# EAGLE schematic xmosio1 (EAGLE 7.6.0)
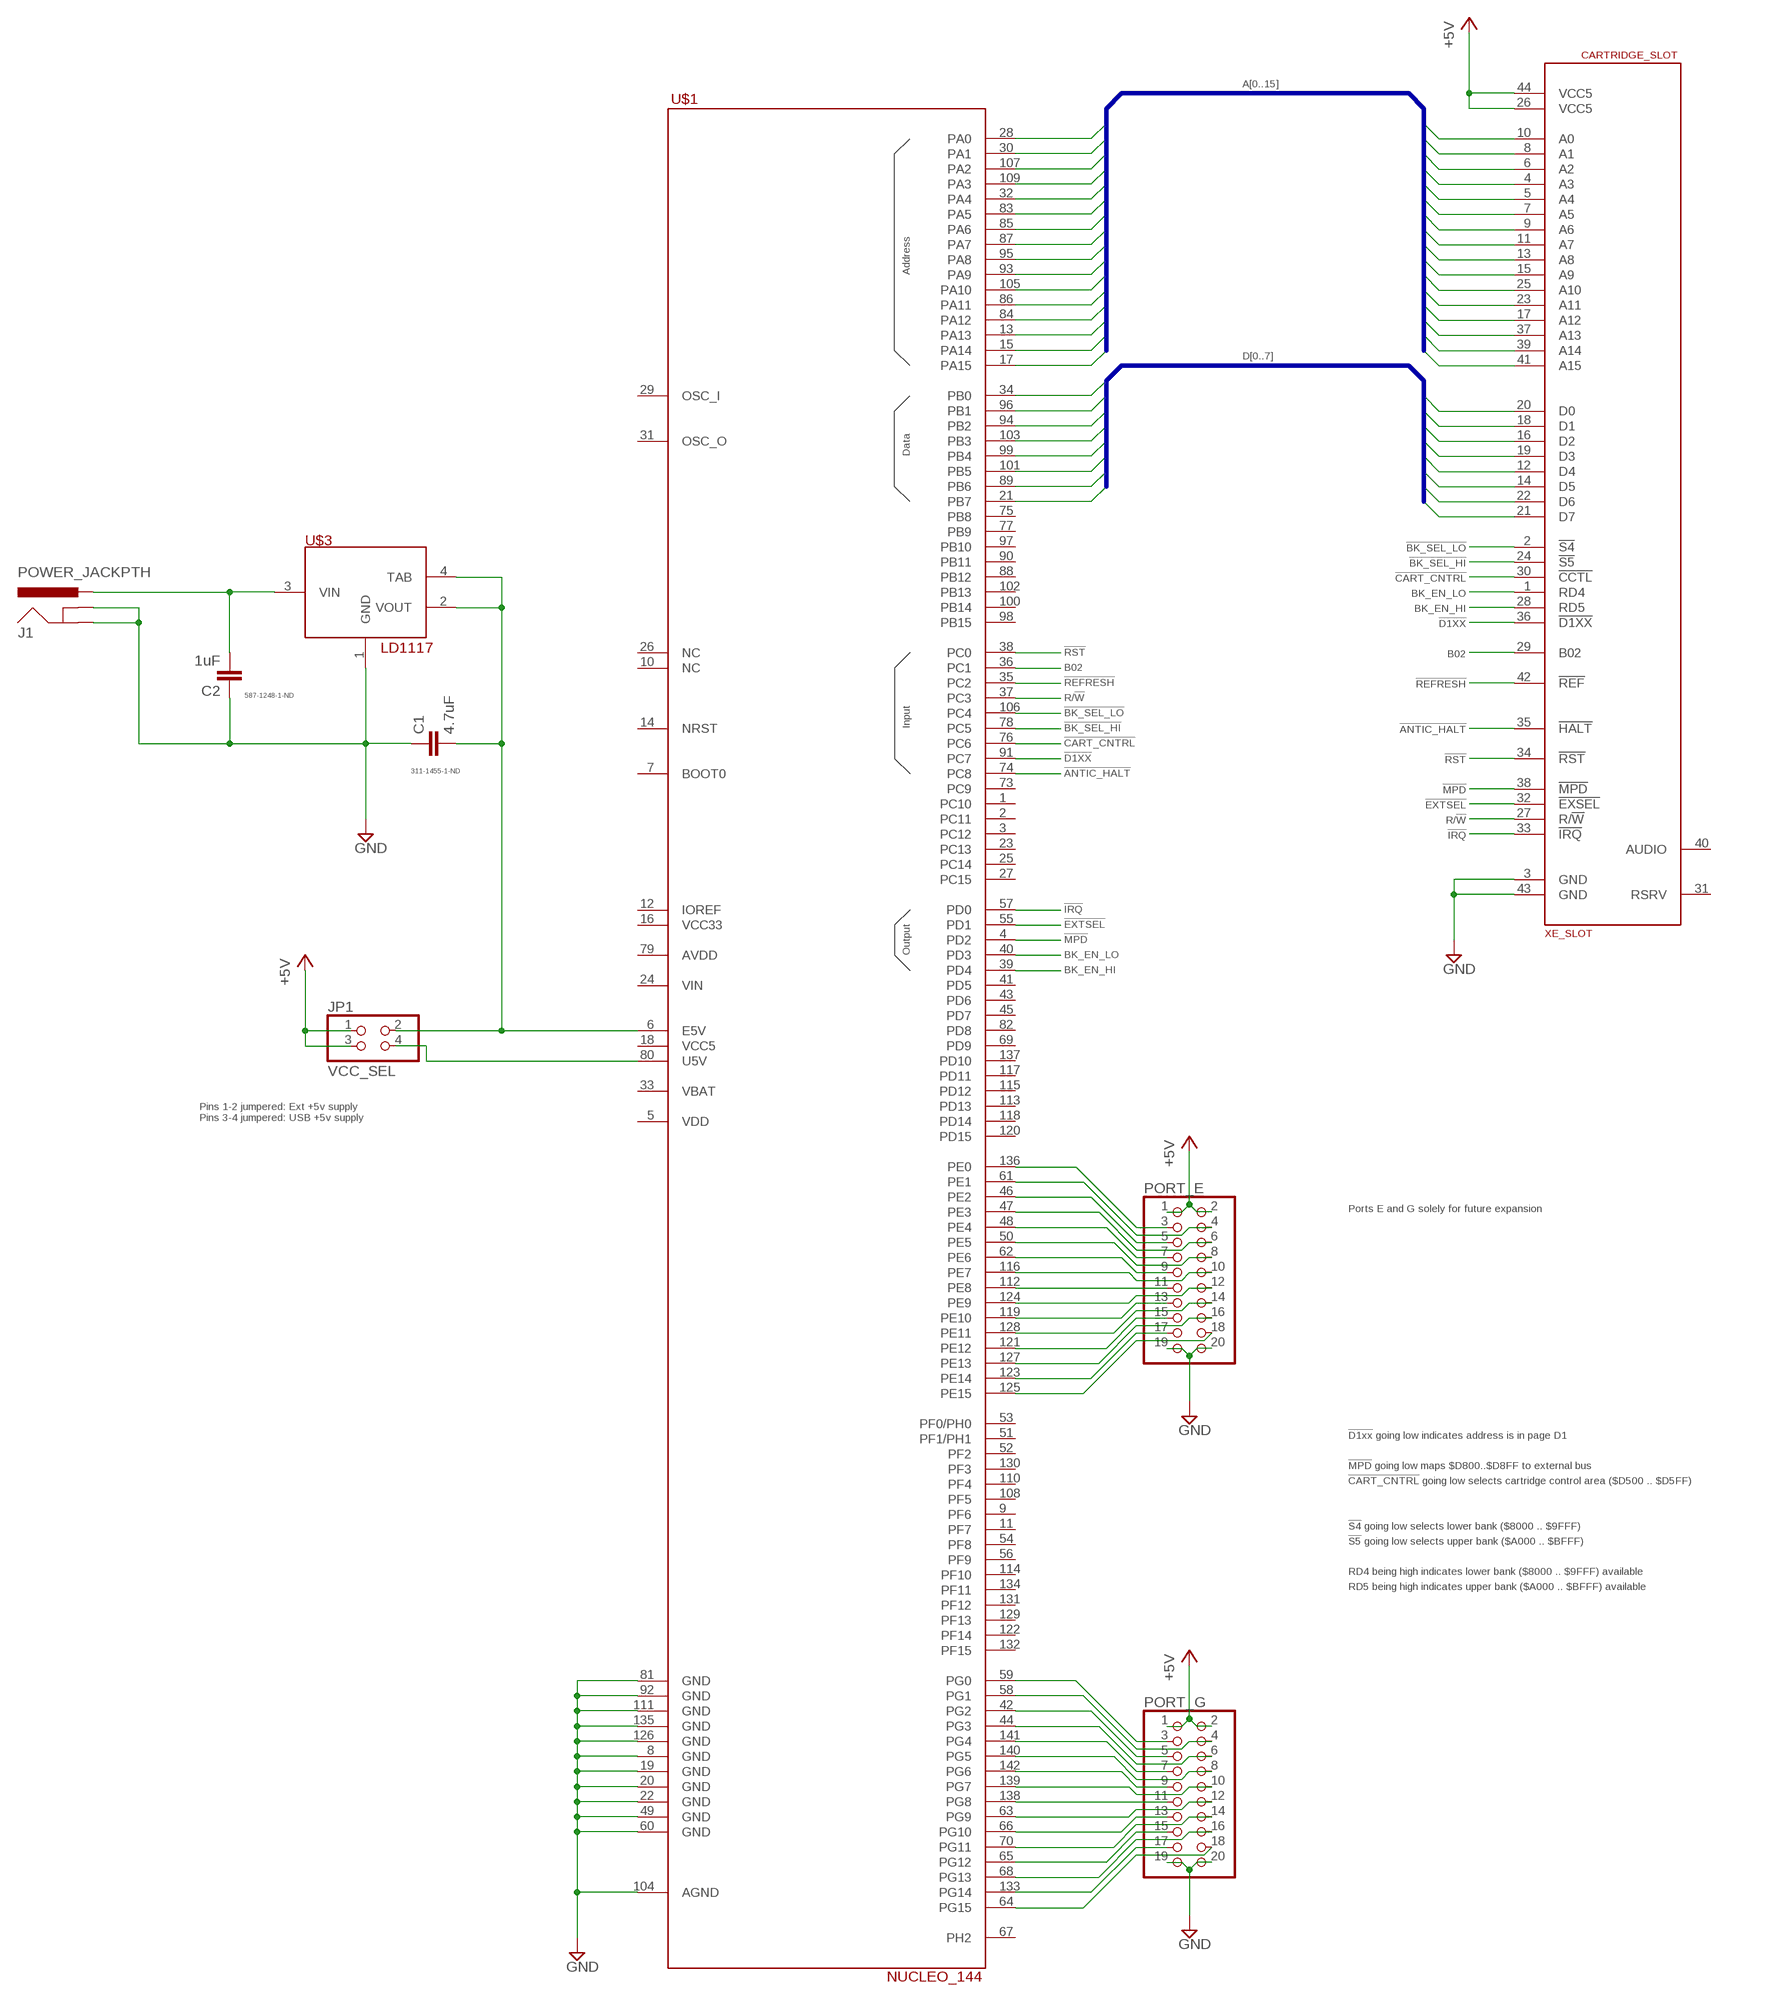
[diagram p0: schematic, sheet 1]

## Parts
C1  4.7uF  C-EUC0603  [C0603]
C2  1uF  C-EUC0603  [C0603]
CARTRIDGE_SLOT  XE_SLOT  [XE_SLOT]
J1  POWER_JACKPTH  [POWER_JACK_PTH]
JP1  VCC_SEL  PINHD-2X2  [2X02]
PORT_E  PINHD-2X10  [2X10]
PORT_G  PINHD-2X10  [2X10]
U$1  NUCLEO_144  [NUCLEO_144]
U$3  LD1117  [SOT223]

## Nets
!ANTIC_HALT!: CARTRIDGE_SLOT.35(!HALT!) U$1.74(PC8)
!BK_SEL_HI!: CARTRIDGE_SLOT.24(!S5!) U$1.78(PC5)
!BK_SEL_LO!: CARTRIDGE_SLOT.2(!S4!) U$1.106(PC4)
!CART_CNTRL!: CARTRIDGE_SLOT.30(!CCTL!) U$1.76(PC6)
!D1XX!: CARTRIDGE_SLOT.36(!D1XX!) U$1.91(PC7)
!EXTSEL!: CARTRIDGE_SLOT.32(!EXSEL!) U$1.55(PD1)
!IRQ!: CARTRIDGE_SLOT.33(!IRQ!) U$1.57(PD0)
!MPD!: CARTRIDGE_SLOT.38(!MPD!) U$1.4(PD2)
!REFRESH!: CARTRIDGE_SLOT.42(!REF!) U$1.35(PC2)
!RST!: CARTRIDGE_SLOT.34(!RST!) U$1.38(PC0)
+5V: CARTRIDGE_SLOT.26(VCC5) CARTRIDGE_SLOT.44(VCC5) JP1.1 JP1.3 PORT_E.1 PORT_E.2 PORT_G.1 PORT_G.2
A0: CARTRIDGE_SLOT.10(A0) U$1.28(PA0)
A1: CARTRIDGE_SLOT.8(A1) U$1.30(PA1)
A2: CARTRIDGE_SLOT.6(A2) U$1.107(PA2)
A3: CARTRIDGE_SLOT.4(A3) U$1.109(PA3)
A4: CARTRIDGE_SLOT.5(A4) U$1.32(PA4)
A5: CARTRIDGE_SLOT.7(A5) U$1.83(PA5)
A6: CARTRIDGE_SLOT.9(A6) U$1.85(PA6)
A7: CARTRIDGE_SLOT.11(A7) U$1.87(PA7)
A8: CARTRIDGE_SLOT.13(A8) U$1.95(PA8)
A9: CARTRIDGE_SLOT.15(A9) U$1.93(PA9)
A10: CARTRIDGE_SLOT.25(A10) U$1.105(PA10)
A11: CARTRIDGE_SLOT.23(A11) U$1.86(PA11)
A12: CARTRIDGE_SLOT.17(A12) U$1.84(PA12)
A13: CARTRIDGE_SLOT.37(A13) U$1.13(PA13)
A14: CARTRIDGE_SLOT.39(A14) U$1.15(PA14)
A15: CARTRIDGE_SLOT.41(A15) U$1.17(PA15)
B02: CARTRIDGE_SLOT.29(B02) U$1.36(PC1)
BK_EN_HI: CARTRIDGE_SLOT.28(RD5) U$1.39(PD4)
BK_EN_LO: CARTRIDGE_SLOT.1(RD4) U$1.40(PD3)
D0: CARTRIDGE_SLOT.20(D0) U$1.34(PB0)
D1: CARTRIDGE_SLOT.18(D1) U$1.96(PB1)
D2: CARTRIDGE_SLOT.16(D2) U$1.94(PB2)
D3: CARTRIDGE_SLOT.19(D3) U$1.103(PB3)
D4: CARTRIDGE_SLOT.12(D4) U$1.99(PB4)
D5: CARTRIDGE_SLOT.14(D5) U$1.101(PB5)
D6: CARTRIDGE_SLOT.22(D6) U$1.89(PB6)
D7: CARTRIDGE_SLOT.21(D7) U$1.21(PB7)
GND [ext-power]: C1.1 C2.1 CARTRIDGE_SLOT.3(GND) CARTRIDGE_SLOT.43(GND) J1.GND J1.GNDBREAK PORT_E.19 PORT_E.20 PORT_G.19 PORT_G.20 U$1.8(GND) U$1.19(GND) U$1.20(GND) U$1.22(GND) U$1.49(GND) U$1.60(GND) U$1.81(GND) U$1.92(GND) U$1.104(AGND) U$1.111(GND) U$1.126(GND) U$1.135(GND) U$3.1(GND)
N$1 [ext-power]: C1.2 JP1.2 U$1.6(E5V) U$3.2(VOUT) U$3.4(TAB)
N$2: JP1.4 U$1.80(U5V)
N$3: PORT_E.3 U$1.136(PE0)
N$4: PORT_E.4 U$1.61(PE1)
N$5: PORT_E.5 U$1.46(PE2)
N$6: PORT_E.6 U$1.47(PE3)
N$7: PORT_E.7 U$1.48(PE4)
N$8: PORT_E.8 U$1.50(PE5)
N$9: PORT_E.9 U$1.62(PE6)
N$10: PORT_E.10 U$1.116(PE7)
N$11: PORT_E.11 U$1.112(PE8)
N$12: PORT_E.12 U$1.124(PE9)
N$13: PORT_E.13 U$1.119(PE10)
N$14: PORT_E.14 U$1.128(PE11)
N$15: PORT_E.15 U$1.121(PE12)
N$16: PORT_E.16 U$1.127(PE13)
N$17: PORT_E.17 U$1.123(PE14)
N$18: PORT_E.18 U$1.125(PE15)
N$19: PORT_G.3 U$1.59(PG0)
N$20: PORT_G.4 U$1.58(PG1)
N$21: PORT_G.5 U$1.42(PG2)
N$22: PORT_G.6 U$1.44(PG3)
N$23: PORT_G.7 U$1.141(PG4)
N$24: PORT_G.8 U$1.140(PG5)
N$25: PORT_G.9 U$1.142(PG6)
N$26: PORT_G.11 U$1.138(PG8)
N$27 [ext-power]: C2.2 J1.PWR U$3.3(VIN)
N$28: PORT_G.12 U$1.63(PG9)
N$29: PORT_G.13 U$1.66(PG10)
N$30: PORT_G.14 U$1.70(PG11)
N$31: PORT_G.15 U$1.65(PG12)
N$32: PORT_G.16 U$1.68(PG13)
N$33: PORT_G.17 U$1.133(PG14)
N$34: PORT_G.18 U$1.64(PG15)
PORT_G: PORT_G.10 U$1.139(PG7)
R/!W!: CARTRIDGE_SLOT.27(R/!W!) U$1.37(PC3)
Unconnected: CARTRIDGE_SLOT.31(RSRV) CARTRIDGE_SLOT.40(AUDIO) U$1.1(PC10) U$1.2(PC11) U$1.3(PC12) U$1.5(VDD) U$1.7(BOOT0) U$1.9(PF6) U$1.10(NC) U$1.11(PF7) U$1.12(IOREF) U$1.14(NRST) U$1.16(VCC33) U$1.18(VCC5) U$1.23(PC13) U$1.24(VIN) U$1.25(PC14) U$1.26(NC) U$1.27(PC15) U$1.29(OSC_I) U$1.31(OSC_O) U$1.33(VBAT) U$1.41(PD5) U$1.43(PD6) U$1.45(PD7) U$1.51(PF1/PH1) U$1.52(PF2) U$1.53(PF0/PH0) U$1.54(PF8) U$1.56(PF9) U$1.67(PH2) U$1.69(PD9) U$1.73(PC9) U$1.75(PB8) U$1.77(PB9) U$1.79(AVDD) U$1.82(PD8) U$1.88(PB12) U$1.90(PB11) U$1.97(PB10) U$1.98(PB15) U$1.100(PB14) U$1.102(PB13) U$1.108(PF5) U$1.110(PF4) U$1.113(PD13) U$1.114(PF10) U$1.115(PD12) U$1.117(PD11) U$1.118(PD14) U$1.120(PD15) U$1.122(PF14) U$1.129(PF13) U$1.130(PF3) U$1.131(PF12) U$1.132(PF15) U$1.134(PF11) U$1.137(PD10)

## Buses
A[0..15]
D[0..7]

## Notes on the sheet
- Address
- Data
- 587-1248-1-ND
- Input
- 311-1455-1-ND
- Output
- Pins 1-2 jumpered: Ext +5v supply
  Pins 3-4 jumpered: USB +5v supply
- Ports E and G solely for future expansion
- !D1xx! going low indicates address is in page D1
- !MPD! going low maps $D800..$D8FF to external bus
- !CART_CNTRL! going low selects cartridge control area ($D500 .. $D5FF)
- !S4! going low selects lower bank ($8000 .. $9FFF)
- !S5! going low selects upper bank ($A000 .. $BFFF)
- RD4 being high indicates lower bank ($8000 .. $9FFF) available
- RD5 being high indicates upper bank ($A000 .. $BFFF) available

## Library data of the parts
C1 C2 = rcl:C-EU: CAPACITOR, European symbol
CARTRIDGE_SLOT = pbxl:XE_SLOT
J1 = SparkFun-Connectors:POWER_JACK: Power Jack This is the standard 5.5mm barrel jack for power. The PTH is the most common, proven, reliable, footprint. The Slot footprint only works if the mill layer is transmitted to the PCB fab house so be warned. Mating wall wart : TOL-00298 (and others); PROD_ID: PRT-00119
JP1 = pinhead:PINHD-2X2: PIN HEADER
PORT_E PORT_G = pinhead:PINHD-2X10: PIN HEADER
U$1 = pbxl:NUCLEO_144
U$3 = sjg-power:LD1117

## Net classes
1 ext-power: width 0.305 mm